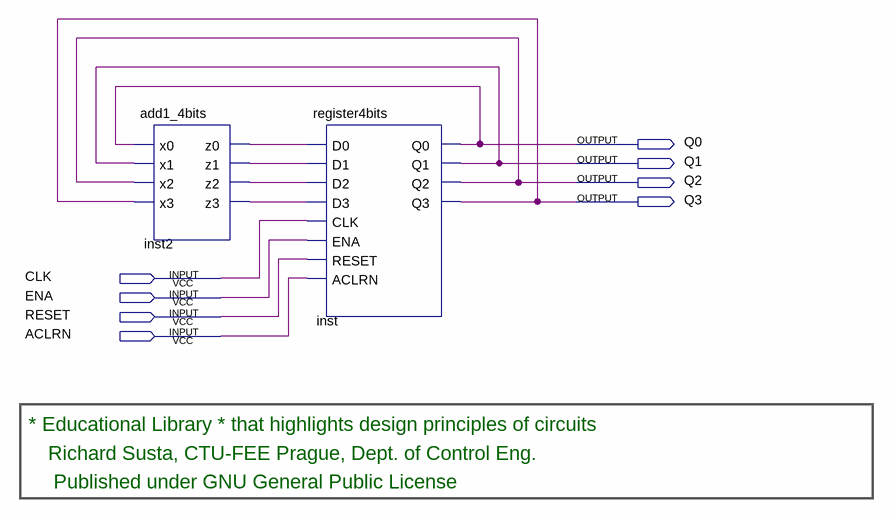
[diagram p0: schematic sheet]
// Quartus schematic counter4bits.bdf as structural Verilog: 2 symbols, 8 pins
module counter4bits (
  input  CLK,
  input  ENA,
  input  RESET,
  input  ACLRN,
  output Q0,
  output Q1,
  output Q2,
  output Q3
);

  wire inst2_z0, inst2_z1, inst2_z2, inst2_z3;

  add1_4bits inst2 (.x0(Q0), .x1(Q1), .x2(Q2), .x3(Q3), .z0(inst2_z0), .z1(inst2_z1), .z2(inst2_z2), .z3(inst2_z3));
  register4bits inst (
    .D0(inst2_z0), .D1(inst2_z1), .D2(inst2_z2), .D3(inst2_z3), .CLK(CLK), .ENA(ENA), .RESET(RESET),
    .ACLRN(ACLRN), .Q0(Q0), .Q1(Q1), .Q2(Q2), .Q3(Q3));

  // Notes on the sheet:
  //   * Educational Library * that highlights design principles of circuits
  //   Richard Susta, CTU-FEE Prague, Dept. of Control Eng. 
  //    Published under GNU General Public License
endmodule
